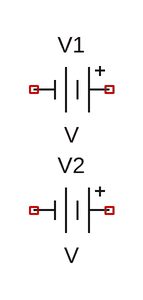
[diagram p0: schematic Powermux.asc]
Powermux.asc, the LTspice schematic file:
Version 4
SHEET 1 880 680
SYMBOL Misc\\battery 96 128 R90
WINDOW 0 -32 56 VBottom 2
WINDOW 3 32 56 VTop 2
SYMATTR InstName V1
SYMBOL Misc\\battery 96 256 R90
WINDOW 0 -32 56 VBottom 2
WINDOW 3 32 56 VTop 2
SYMATTR InstName V2

The netlist it stands for:
* Powermux.asc
V1 NC_01 NC_02 V
V2 NC_03 NC_04 V
.backanno
.end